# Altium project MCU_PCB.PrjPcb
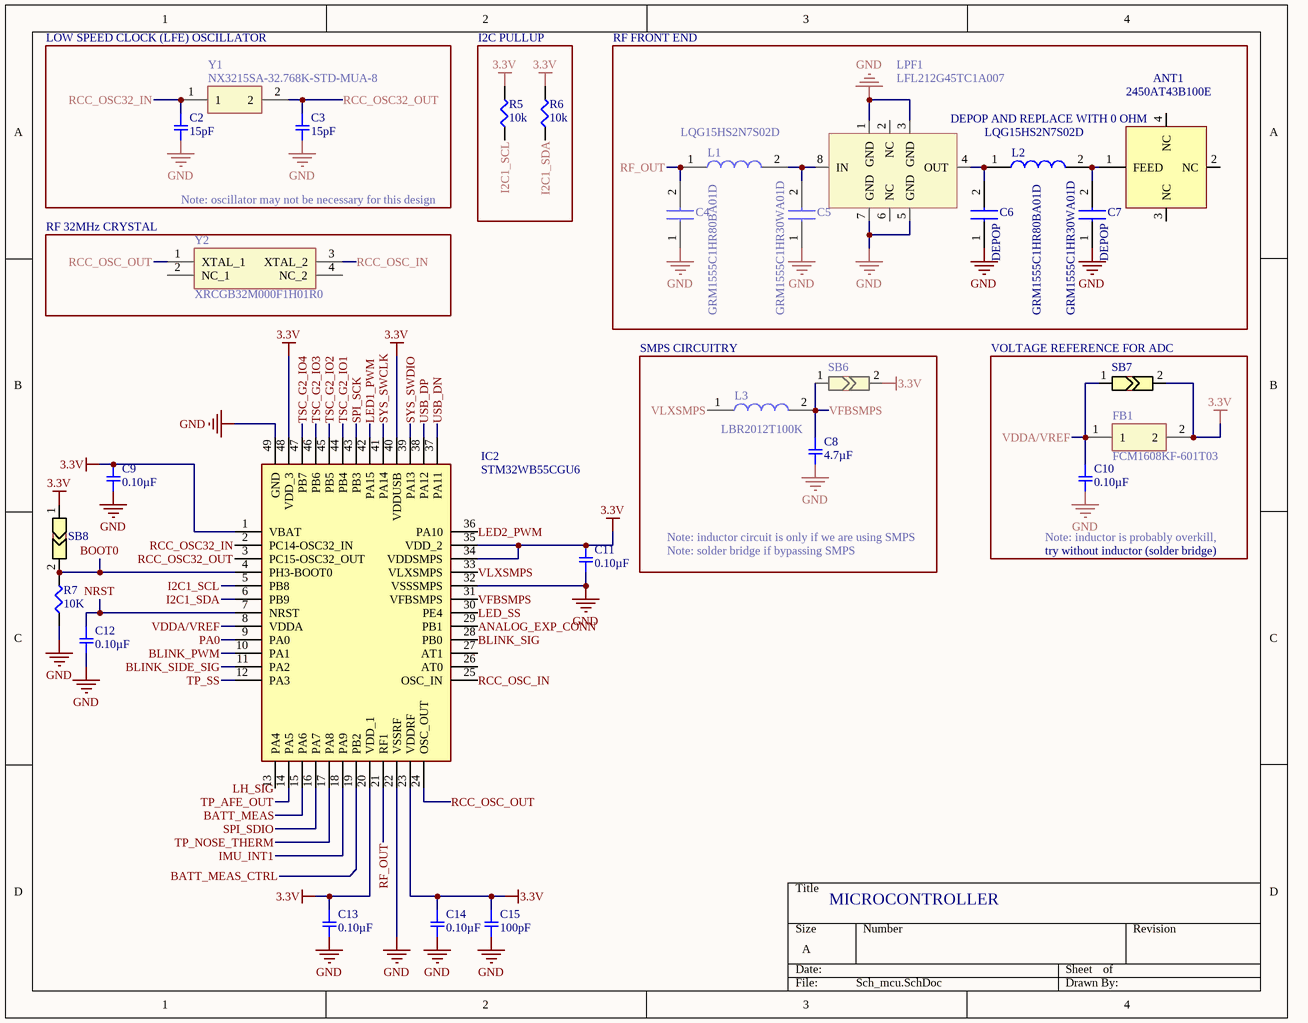
[diagram p0: Sch_mcu.SchDoc]
5 sheets, 94 parts. Net scope: global (net labels, ports and power ports of the same name join across sheets).
Board file: MCU_PCB_v2.PcbDoc
Sheets:
  Sch_mcu.SchDoc
  Sch_sensors.SchDoc
  Sch_external_connectors.SchDoc
  Sch_pwr.SchDoc
  Sch_stackup_mcu_pcb.SchDoc

## Sheet Sch_mcu.SchDoc
size A

### Parts
ANT1  2450AT43B100E  [2450AT43B100E]
C2  15pF  [SMD-0402C]
C3  15pF  [SMD-0402C]
C4  GRM1555C1HR80BA01D  [CAPC1005X55N]
C5  GRM1555C1HR30WA01D  [CAPC1005X55N]
C6  GRM1555C1HR80BA01D  [CAPC1005X55N]
C7  GRM1555C1HR30WA01D  [CAPC1005X55N]
C8  4.7µF  [SMD-0402C]
C9  0.10µF  [SMD-0402C]
C10  0.10µF  [SMD-0402C]
C11  0.10µF  [SMD-0402C]
C12  0.10µF  [SMD-0402C]
C13  0.10µF  [SMD-0402C]
C14  0.10µF  [SMD-0402C]
C15  100pF  [SMD-0402C]
FB1  FCM1608KF-601T03  [BEADC1608X95N]
IC2  STM32WB55CGU6  [QFN50P700X700X65-49N-D]
L1  LQG15HS2N7S02D  [INDC1005X55N]
L2  LQG15HS2N7S02D  [INDC1005X55N]
L3  LBR2012T100K  [INDC2012X145N]
LPF1  LFL212G45TC1A007  [LFL212G45TC1A007]
R5  10k  [SMD-0402-RES]
R6  10k  [SMD-0402-RES]
R7  10K  [SMD-0402-RES]
SB6  SOLDER_JUMPER  [JUMPER_SMD]  (value not drawn)
SB7  SOLDER_JUMPER  [JUMPER_SMD]  (value not drawn)
SB8  SOLDER_JUMPER  [JUMPER_SMD]  (value not drawn)
Y1  NX3215SA-32.768K-STD-MUA-8  [NX3215SA]
Y2  XRCGB32M000F1H01R0  [XRCGB32M000F1H01R0]

### Blocks framed on the sheet
I2C PULLUP: R5 R6
RF 32MHz CRYSTAL: Y2

### Nets
3.3V: C9.1 C11.1 C13.1 C14.1 C15.1 FB1.2 IC2.1(VBAT) IC2.20(VDD_1) IC2.23(VDDRF) IC2.34(VDDSMPS) IC2.35(VDD_2) IC2.40(VDDUSB) IC2.48(VDD_3) R5.2 R6.2 SB6.2 SB7.2 SB8.1
GND: C2.2 C3.2 C4.1 C5.1 C6.1 C7.1 C8.2 C9.2 C10.2 C11.2 C12.2 C13.2 C14.2 C15.2 IC2.22(VSSRF) IC2.32(VSSSMPS) IC2.49(GND) LPF1.1(GND) LPF1.3(GND) LPF1.5(GND) LPF1.7(GND) R7.1
ANALOG_EXP_CONN: IC2.29(PB1)
BATT_MEAS: IC2.15(PA6)
BATT_MEAS_CTRL: IC2.19(PB2)
BLINK_PWM: IC2.10(PA1)
BLINK_SIDE_SIG: IC2.11(PA2)
BLINK_SIG: IC2.28(PB0)
BOOT0: IC2.4(PH3-BOOT0) R7.2 SB8.2
I2C1_SCL: IC2.5(PB8) R5.1
I2C1_SDA: IC2.6(PB9) R6.1
IMU_INT1: IC2.18(PA9)
LED1_PWM: IC2.42(PA15)
LED2_PWM: IC2.36(PA10)
LED_SS: IC2.30(PE4)
LH_SIG: IC2.13(PA4)
NRST: C12.1 IC2.7(NRST)
PA0: IC2.9(PA0)
RCC_OSC32_IN: C2.1 IC2.2(PC14-OSC32_IN) Y1.1
RCC_OSC32_OUT: C3.1 IC2.3(PC15-OSC32_OUT) Y1.2
RCC_OSC_IN: IC2.25(OSC_IN) Y2.3(XTAL_2)
RCC_OSC_OUT: IC2.24(OSC_OUT) Y2.1(XTAL_1)
RF_OUT: C4.2 IC2.21(RF1) L1.1
SPI_SCK: IC2.43(PB3)
SPI_SDIO: IC2.16(PA7)
SYS_SWCLK: IC2.41(PA14)
SYS_SWDIO: IC2.39(PA13)
TP_AFE_OUT: IC2.14(PA5)
TP_NOSE_THERM: IC2.17(PA8)
TP_SS: IC2.12(PA3)
TSC_G2_IO1: IC2.44(PB4)
TSC_G2_IO2: IC2.45(PB5)
TSC_G2_IO3: IC2.46(PB6)
TSC_G2_IO4: IC2.47(PB7)
USB_DN: IC2.37(PA11)
USB_DP: IC2.38(PA12)
VDDA/VREF: C10.1 FB1.1 IC2.8(VDDA) SB7.1
VFBSMPS: C8.1 IC2.31(VFBSMPS) L3.2 SB6.1
VLXSMPS: IC2.33(VLXSMPS) L3.1
NetANT1_1: ANT1.1(FEED) C7.2 L2.2
NetC5_2: C5.2 L1.2 LPF1.8(IN)
NetC6_2: C6.2 L2.1 LPF1.4(OUT)

Not connected (* = marked no-connect by the designer): ANT1 2(NC) 3(NC) 4(NC); IC2 26(AT0) 27(AT1); LPF1 2(NC) 6(NC); Y2 2(NC_1) 4(NC_2)

### Notes on the sheet
- LOW SPEED CLOCK (LFE) OSCILLATOR
- RF FRONT END
- DEPOP AND REPLACE WITH 0 OHM
- Note: oscillator may not be necessary for this design
- (near C6) DEPOP
- (near C7) DEPOP
- SMPS CIRCUITRY
- (near SB7) VOLTAGE REFERENCE FOR ADC
- Note: inductor circuit is only if we are using SMPS
- Note: solder bridge if bypassing SMPS
- (near C10) Note: inductor is probably overkill,
- try without inductor (solder bridge)
- MICROCONTROLLER

### Library data of the parts
C2 C3 = GCM1555C1H150JA16D: CAP CER 15PF 50V NP0 0402; Manufacturer: Murata Electronics North America; Factory Stock: 0; Unit Price (USD): 0.1; Minimum Quantity: 1; Tolerance: ±5%; Temperature Coefficient: C0G, NP0; Datasheets: http://www.murata.com/~/media/webrenewal/support/library/catalog/products/capacitor/mlcc/c03e.ashx; Image: //media.digikey.com/Renders/Murata%20Renders/ZRB-SERIES-0402.jpg; Digi-Key Part Number: 490-11147-1-ND; Part Number: GCM1555C1H150JA16D; Quantity Available: 6185; @ qty: 0; Packaging: Cut Tape (CT); Series: GCM; Part Status: Active; Value: 15pF; Voltage: 50V; Operating Temperature: -55°C ~ 125°C; Features: -; Ratings: AEC-Q200; Applications: Automotive; Mounting Type: Surface Mount, MLCC; Package / Case: 0402 (1005 Metric); Size / Dimension: 0.039" L x 0.020" W (1.00mm x 0.50mm); Height - Seated (Max): -; Thickness (Max): 0.022" (0.55mm); Lead Spacing: -; Lead Style: -
C4 C6 = GRM1555C1HR80BA01D: Capacitor; Manufacturer_Name: Murata Electronics; Datasheet Link: http://www.murata.com/~/media/webrenewal/support/library/catalog/products/capacitor/mlcc/c02e.pdf; Height: 0.55mm; Manufacturer_Part_Number: GRM1555C1HR80BA01D; Mouser Part Number: 81-GRM1555C1HR80BA1D; Mouser Price/Stock: https://www.mouser.com/Search/Refine.aspx?Keyword=81-GRM1555C1HR80BA1D; RS Part Number: 8145426P; RS Price/Stock: http://uk.rs-online.com/web/p/products/8145426P
C5 C7 = GRM1555C1HR30WA01D: Capacitor; Manufacturer_Name: Murata Electronics; Datasheet Link: http://www.murata.com/~/media/webrenewal/support/library/catalog/products/capacitor/mlcc/c02e.pdf; Height: 0.55mm; Manufacturer_Part_Number: GRM1555C1HR30WA01D; Mouser Part Number: 81-GRM1555C1HR30WA1D; Mouser Price/Stock: https://www.mouser.com/Search/Refine.aspx?Keyword=81-GRM1555C1HR30WA1D; RS Part Number: 8145394P; RS Price/Stock: http://uk.rs-online.com/web/p/products/8145394P
C8 = GRM153R60G475ME15D: CAP CER 4.7UF 4V X5R 0402; Manufacturer: Murata Electronics North America; Factory Stock: 0; Unit Price (USD): 0.27; Minimum Quantity: 1; Tolerance: ±20%; Datasheets: http://psearch.en.murata.com/capacitor/product/GRM153R60G475ME15%23.pdf; Image: //media.digikey.com/Renders/Murata%20Renders/ZRB-SERIES-0402.jpg; Digi-Key Part Number: 490-13231-1-ND; Part Number: GRM153R60G475ME15D; Quantity Available: 9100; @ qty: 0; Packaging: Cut Tape (CT); Series: GRM; Part Status: Active; Value: 4.7µF; Voltage: 4V; Temperature Coefficient: X5R; Operating Temperature: -55°C ~ 85°C; Features: -; Ratings: -; Applications: General Purpose; Mounting Type: Surface Mount, MLCC; Package / Case: 0402 (1005 Metric); Size / Dimension: 0.039" L x 0.020" W (1.00mm x 0.50mm); Height - Seated (Max): -; Thickness (Max): 0.013" (0.33mm); Lead Spacing: -; Lead Style: -
C9-C14 = GCM155R71C104KA55D: CAP CER 0.1UF 16V X7R 0402; Manufacturer: Murata Electronics North America; Factory Stock: 0; Unit Price (USD): 0.1; Minimum Quantity: 1; Tolerance: ±10%; Datasheets: http://www.murata.com/~/media/webrenewal/support/library/catalog/products/capacitor/mlcc/c03e.ashx; Image: //media.digikey.com/Renders/Murata%20Renders/ZRB-SERIES-0402.jpg; Digi-Key Part Number: 490-4759-1-ND; Part Number: GCM155R71C104KA55D; Quantity Available: 734194; @ qty: 0; Packaging: Cut Tape (CT); Series: GCM; Part Status: Active; Value: 0.10µF; Voltage: 16V; Temperature Coefficient: X7R; Operating Temperature: -55°C ~ 125°C; Features: -; Ratings: AEC-Q200; Applications: Automotive; Mounting Type: Surface Mount, MLCC; Package / Case: 0402 (1005 Metric); Size / Dimension: 0.039" L x 0.020" W (1.00mm x 0.50mm); Height - Seated (Max): -; Thickness (Max): 0.022" (0.55mm); Lead Spacing: -; Lead Style: -
C15 = GCM1555C1H101JA16D: CAP CER 100PF 50V NP0 0402; Manufacturer: Murata Electronics North America; Factory Stock: 0; Unit Price (USD): 0.1; Minimum Quantity: 1; Tolerance: ±5%; Temperature Coefficient: C0G, NP0; Datasheets: http://www.murata.com/~/media/webrenewal/support/library/catalog/products/capacitor/mlcc/c03e.ashx; Image: //media.digikey.com/Renders/Murata%20Renders/ZRB-SERIES-0402.jpg; Digi-Key Part Number: 490-10669-1-ND; Part Number: GCM1555C1H101JA16D; Quantity Available: 61397; @ qty: 0; Packaging: Cut Tape (CT); Series: GCM; Part Status: Active; Value: 100pF; Voltage: 50V; Operating Temperature: -55°C ~ 125°C; Features: -; Ratings: AEC-Q200; Applications: Automotive; Mounting Type: Surface Mount, MLCC; Package / Case: 0402 (1005 Metric); Size / Dimension: 0.039" L x 0.020" W (1.00mm x 0.50mm); Height - Seated (Max): -; Thickness (Max): 0.022" (0.55mm); Lead Spacing: -; Lead Style: -
FB1 = FCM1608KF-601T03: Ferrite Bead; Manufacturer_Name: TAI-TECH; Datasheet Link: https://www.tai-tech.com.tw/_upload/files/FCM1608-Series.pdf; Height: 0.95mm; Manufacturer_Part_Number: FCM1608KF-601T03
IC2 = STM32WB55CGU6: Integrated Circuit; Manufacturer_Name: STMicroelectronics; Datasheet Link: https://www.st.com/en/microcontrollers/stm32wb55cg.html; Height: 0.65mm; Manufacturer_Part_Number: STM32WB55CGU6; Mouser Part Number: 511-STM32WB55CGU6; Mouser Price/Stock: https://www.mouser.com/Search/Refine.aspx?Keyword=511-STM32WB55CGU6
L1 L2 = LQG15HS2N7S02D: Inductor; Manufacturer_Name: Murata Electronics; Datasheet Link: https://www.arrow.com/en/products/lqg15hs2n7s02d/murata-manufacturing; Height: 0.55mm; Manufacturer_Part_Number: LQG15HS2N7S02D
L3 = LBR2012T100K: Inductor; Manufacturer_Name: TAIYO YUDEN; Datasheet Link: https://componentsearchengine.com/Datasheets/2/LBR2012T100K.pdf; Height: 1.45mm; Manufacturer_Part_Number: LBR2012T100K; Mouser Part Number: 963-LBR2012T100K; Mouser Price/Stock: https://www.mouser.com/Search/Refine.aspx?Keyword=963-LBR2012T100K
R5 R6 = ERJ-2GEJ103X: RES SMD 10K OHM 5% 1/10W 0402; Manufacturer: Panasonic Electronic Components; Factory Stock: 0; Unit Price (USD): 0.00350; @ qty: 1500; Minimum Quantity: 1; Power (Watts): 0.1W, 1/10W; Temperature Coefficient: ±200ppm/°C; Part Number: ERJ-2GEJ103X; Datasheets: http://industrial.panasonic.com/www-cgi/jvcr13pz.cgi?E+PZ+3+AOA0001+ERJ2GEJ103X+7+WW; Image: //media.digikey.com/Photos/Panasonic%20Photos/ERJ-PA2-Series.jpg; Digi-Key Part Number: P10KJCT-ND; Quantity Available: 2560215; Packaging: Cut Tape (CT); Series: ERJ; Part Status: Active; Value: 10k; Tolerance: ±5%; Composition: Thick Film; Features: Automotive AEC-Q200; Operating Temperature: -55°C ~ 155°C; Package / Case: 0402 (1005 Metric); Supplier Device Package: 0402; Size / Dimension: 0.039" L x 0.020" W (1.00mm x 0.50mm); Height - Seated (Max): 0.016" (0.40mm); Number of Terminations: 2; Failure Rate: -
R7 = ERJ-2RKF1003X: RES SMD 10K OHM 1% 1/10W 0402; Manufacturer: Panasonic Electronic Components; Factory Stock: 0; Unit Price (USD): 0.00496; @ qty: 1500; Minimum Quantity: 1; Power (Watts): 0.1W, 1/10W; Temperature Coefficient: ±100ppm/°C; Part Number: ERJ-2RKF1003X; Datasheets: http://industrial.panasonic.com/www-cgi/jvcr13pz.cgi?E+PZ+3+AOA0002+ERJ2RKF1003X+7+WW; Image: //media.digikey.com/Photos/Panasonic%20Photos/ERJ-PA2-Series.jpg; Digi-Key Part Number: P100KLCT-ND; Quantity Available: 2645965; Packaging: Cut Tape (CT); Series: ERJ; Part Status: Active; Value: 10K; Tolerance: ±1%; Composition: Thick Film; Features: Automotive AEC-Q200; Operating Temperature: -55°C ~ 155°C; Package / Case: 0402 (1005 Metric); Supplier Device Package: 0402; Size / Dimension: 0.039" L x 0.020" W (1.00mm x 0.50mm); Height - Seated (Max): 0.016" (0.40mm); Number of Terminations: 2; Failure Rate: -
Y1 = NX3215SA-32.768K-STD-MUA-8: Crystal or Oscillator; Manufacturer_Name: NDK; Datasheet Link: http://www.ndk.com/images/products/catalog/c_NX3215SA-STD-MUA-14_e.pdf; Manufacturer_Part_Number: NX3215SA-32.768K-STD-MUA-8; Mouser Part Number: 344-NX3215SA32768K8; Mouser Price/Stock: https://www.mouser.com/Search/Refine.aspx?Keyword=344-NX3215SA32768K8
Y2 = XRCGB32M000F1H01R0: Crystal or Oscillator; Manufacturer_Name: Murata Electronics; Datasheet Link: https://www.murata.com/en-eu/products/productdetail?partno=XRCGB32M000F1H01R0; Height: 0.7mm; Manufacturer_Part_Number: XRCGB32M000F1H01R0; Mouser Part Number: 81-XRCGB32M000F1H01R; Mouser Price/Stock: https://www.mouser.com/Search/Refine.aspx?Keyword=81-XRCGB32M000F1H01R

## Sheet Sch_sensors.SchDoc
size A
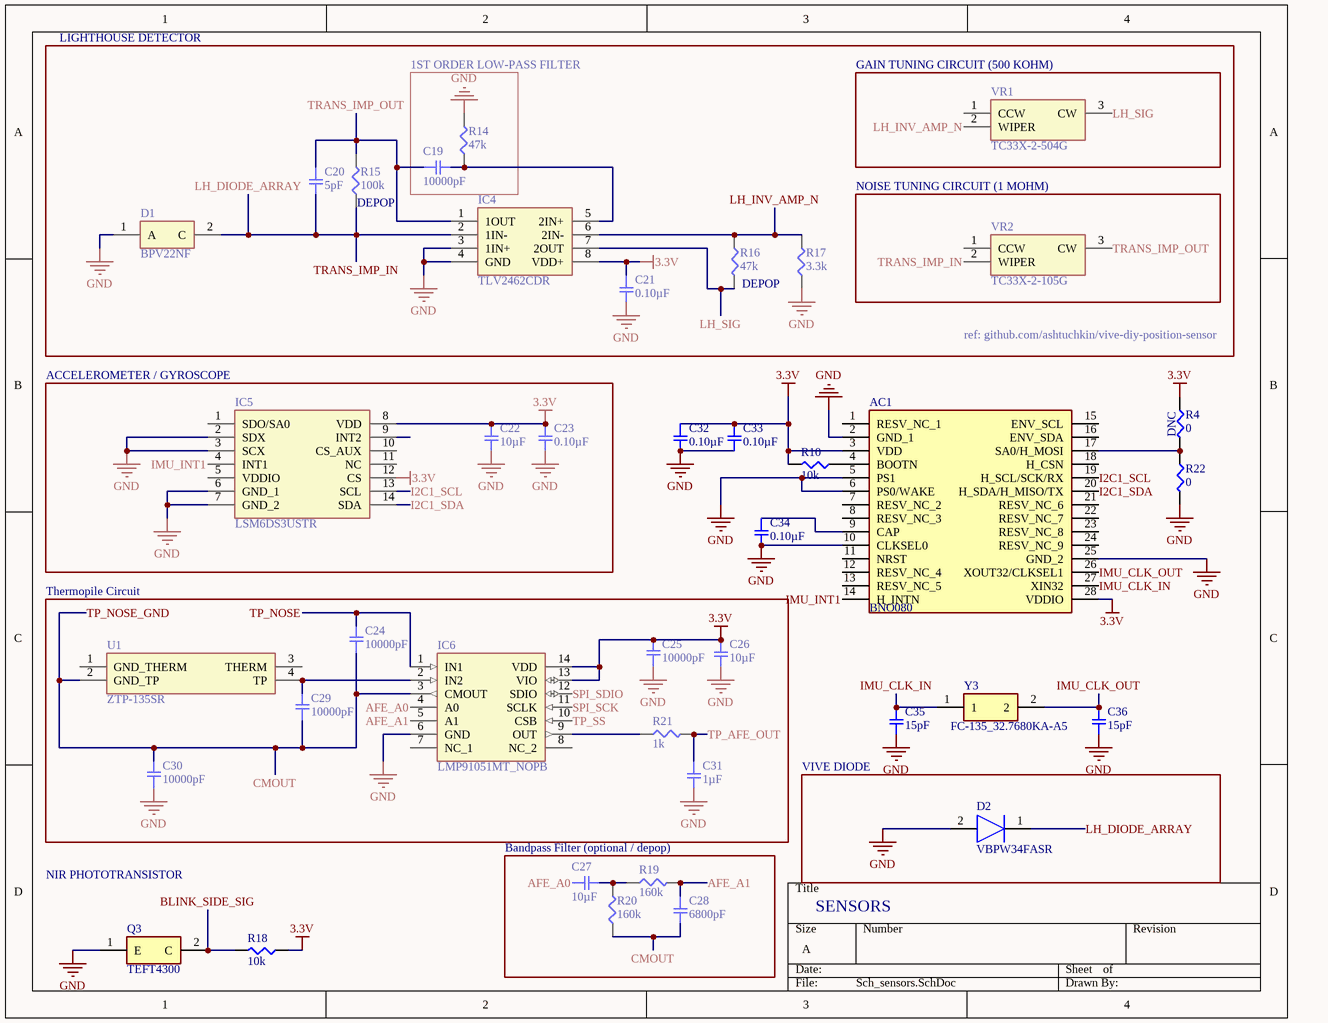
[diagram p1: Sch_sensors.SchDoc]

### Parts
AC1  BNO080  [BNO080]
C19  10000pF  [SMD-0402C]
C20  5pF  [SMD-0402C]
C21  0.10µF  [SMD-0402C]
C22  10µF  [SMD-0402C]
C23  0.10µF  [SMD-0402C]
C24  10000pF  [SMD-0402C]
C25  10000pF  [SMD-0402C]
C26  10µF  [SMD-0402C]
C27  10µF  [SMD-0402C]
C28  6800pF  [SMD-0402C]
C29  10000pF  [SMD-0402C]
C30  10000pF  [SMD-0402C]
C31  1µF  [SMD-0402C]
C32  0.10µF  [CAPC1005X55N]
C33  0.10µF  [CAPC1005X55N]
C34  0.10µF  [CAPC1005X55N]
C35  15pF  [CAPC1005X55N]
C36  15pF  [CAPC1005X55N]
D1  BPV22NF  [TO254P510X450X920-2P]
D2  VBPW34FASR  [VBPW34FASR]
IC4  TLV2462CDR  [SOIC127P600X175-8N]
IC5  LSM6DS3USTR  [LGA-14(2.5X3X0.86)]
IC6  LMP91051MT_NOPB  [SOP65P640X120-14N]
Q3  TEFT4300  [TEFT4300]
R4  0  [SMD-0402-RES]
R10  10k  [SMD-0402-RES]
R14  47k  [SMD-0402-RES]
R15  100k  [SMD-0402-RES]
R16  47k  [SMD-0402-RES]
R17  3.3k  [SMD-0402-RES]
R18  10k  [SMD-0402-RES]
R19  160k  [SMD-0402-RES]
R20  160k  [SMD-0402-RES]
R21  1k  [SMD-0402-RES]
R22  0  [SMD-0402-RES]
U1  ZTP-135SR  [ZTP-135SR]
VR1  TC33X-2-504G  [TC33X-2_1]
VR2  TC33X-2-105G  [TC33X-2_1]
Y3  FC-135_32.7680KA-A5  [FC135327680KAAG0]

### Blocks framed on the sheet
1ST ORDER LOW-PASS FILTER: C19 R14
GAIN TUNING CIRCUIT (500 KOHM): VR1
NOISE TUNING CIRCUIT (1 MOHM): VR2
ACCELEROMETER / GYROSCOPE: C22 C23 IC5
Thermopile Circuit: C24-C26 C29-C31 IC6 R21 U1
VIVE DIODE: D2
Bandpass Filter (optional / depop): C27 C28 R19 R20

### Nets
3.3V: AC1.3(VDD) AC1.28(VDDIO) C21.1 C22.1 C23.1 C25.2 C26.1 C32.1 C33.1 IC4.8(VDD+) IC5.8(VDD) IC5.12(CS) IC6.13(VIO) IC6.14(VDD) R4.1 R10.2 R18.1
GND: AC1.2(GND_1) AC1.5(PS1) AC1.6(PS0/WAKE) AC1.10(CLKSEL0) AC1.25(GND_2) C21.2 C22.2 C23.2 C25.1 C26.2 C30.1 C31.2 C32.2 C33.2 C34.2 C35.2 C36.2 D1.1(A) D2.2(K) IC4.3(1IN+) IC4.4(GND) IC5.2(SDX) IC5.3(SCX) IC5.6(GND_1) IC5.7(GND_2) IC6.6(GND) Q3.1(E) R14.2 R17.1 R22.2
AFE_A0: C27.1 IC6.4(A0)
AFE_A1: C28.1 IC6.5(A1) R19.2
BLINK_SIDE_SIG: Q3.2(C) R18.2
CMOUT: C24.1 C28.2 C29.1 C30.2 IC6.3(CMOUT) R20.1 U1.2(GND_TP)  [also labelled TP_NOSE_GND]
I2C1_SCL: AC1.19(H_SCL/SCK/RX) IC5.13(SCL)
I2C1_SDA: AC1.20(H_SDA/H_MISO/TX) IC5.14(SDA)
IMU_CLK_IN: AC1.27(XIN32) C35.1 Y3.1
IMU_CLK_OUT: AC1.26(XOUT32/CLKSEL1) C36.1 Y3.2
IMU_INT1: AC1.14(H_INTN) IC5.4(INT1)
LH_DIODE_ARRAY: C20.2 D1.2(C) D2.1(A) IC4.2(1IN-) R15.1 VR2.2(WIPER)  [also labelled TRANS_IMP_IN]
LH_INV_AMP_N: IC4.6(2IN-) R16.1 R17.2 VR1.2(WIPER)
LH_SIG: IC4.7(2OUT) R16.2 VR1.3(CW)
SPI_SCK: IC6.11(SCLK)
SPI_SDIO: IC6.12(SDIO)
TP_AFE_OUT: C31.1 R21.2
TP_NOSE: C24.2 IC6.1(IN1)
TP_SS: IC6.10(CSB)
TRANS_IMP_OUT: C19.1 C20.1 IC4.1(1OUT) R15.2 VR2.3(CW)
NetAC1_4: AC1.4(BOOTN) R10.1
NetAC1_9: AC1.9(CAP) C34.1
NetAC1_17: AC1.17(SA0/H_MOSI) R4.2 R22.1
NetC19_2: C19.2 IC4.5(2IN+) R14.1
NetC27_2: C27.2 R19.1 R20.2
NetC29_2: C29.2 IC6.2(IN2) U1.4(TP)
NetIC6_9: IC6.9(OUT) R21.1

Not connected (* = marked no-connect by the designer): AC1 1(RESV_NC_1) 7(RESV_NC_2) 8(RESV_NC_3) 11(NRST) 12(RESV_NC_4) 13(RESV_NC_5) 15(ENV_SCL) 16(ENV_SDA) 18(H_CSN) 21(RESV_NC_6) 22(RESV_NC_7) 23(RESV_NC_8) 24(RESV_NC_9); IC5 1(SDO/SA0) 5(VDDIO) 9(INT2) 10(CS_AUX) 11(NC); IC6 7(NC_1) 8(NC_2); U1 1(GND_THERM) 3(THERM); VR1 1(CCW); VR2 1(CCW)

### Notes on the sheet
- LIGHTHOUSE DETECTOR
- (near R15) DEPOP
- (near R16) DEPOP
- ref: github.com/ashtuchkin/vive-diy-position-sensor
- (near R4) DNC
- NIR PHOTOTRANSISTOR
- SENSORS

### Library data of the parts
AC1 = BNO080: Accelerometer; Manufacturer_Name: Hillcrest Laboratories; Datasheet Link: http://www.hillcrestlabs.com/download/5a05f340566d07c196001ec1; Height: 1.18mm; Manufacturer_Part_Number: BNO080
C19 C24 C25 C29 C30 = GCM155R71H103KA55D: CAP CER 10000PF 50V X7R 0402; Manufacturer: Murata Electronics North America; Factory Stock: 0; Unit Price (USD): 0.1; Minimum Quantity: 1; Tolerance: ±10%; Datasheets: http://www.murata.com/~/media/webrenewal/support/library/catalog/products/capacitor/mlcc/c03e.ashx; Image: //media.digikey.com/Renders/Murata%20Renders/ZRB-SERIES-0402.jpg; Digi-Key Part Number: 490-4762-1-ND; Part Number: GCM155R71H103KA55D; Quantity Available: 650067; @ qty: 0; Packaging: Cut Tape (CT); Series: GCM; Part Status: Active; Value: 10000pF; Voltage: 50V; Temperature Coefficient: X7R; Operating Temperature: -55°C ~ 125°C; Features: -; Ratings: AEC-Q200; Applications: Automotive; Mounting Type: Surface Mount, MLCC; Package / Case: 0402 (1005 Metric); Size / Dimension: 0.039" L x 0.020" W (1.00mm x 0.50mm); Height - Seated (Max): -; Thickness (Max): 0.022" (0.55mm); Lead Spacing: -; Lead Style: -
C20 = GJM1555C1H5R0BB01D: CAP CER 5PF 50V NP0 0402; Manufacturer: Murata Electronics North America; Factory Stock: 0; Unit Price (USD): 0.2; Minimum Quantity: 1; Tolerance: ±0.1pF; Temperature Coefficient: C0G, NP0; Datasheets: http://www.murata.com/~/media/webrenewal/support/library/catalog/products/capacitor/mlcc/c02e.pdf; Image: //media.digikey.com/Renders/Murata%20Renders/ZRB-SERIES-0402.jpg; Digi-Key Part Number: 490-8103-1-ND; Part Number: GJM1555C1H5R0BB01D; Quantity Available: 17055; @ qty: 0; Packaging: Cut Tape (CT); Series: GJM; Part Status: Active; Value: 5pF; Voltage: 50V; Operating Temperature: -55°C ~ 125°C; Features: High Q, Low Loss; Ratings: -; Applications: RF, Microwave, High Frequency; Mounting Type: Surface Mount, MLCC; Package / Case: 0402 (1005 Metric); Size / Dimension: 0.039" L x 0.020" W (1.00mm x 0.50mm); Height - Seated (Max): -; Thickness (Max): 0.022" (0.55mm); Lead Spacing: -; Lead Style: -
C21 C23 C32-C34 = GCM155R71C104KA55D: as C9 on sheet Sch_mcu; Datasheets: http://www.murata.com/~/media/webrenewal/support/library/catalog/products/capacitor/mlcc/c03e.ashx; Image: //media.digikey.com/Renders/Murata%20Renders/ZRB-SERIES-0402.jpg; Digi-Key Part Number: 490-4759-1-ND; Part Number: GCM155R71C104KA55D; Quantity Available: 734194; @ qty: 0; Packaging: Cut Tape (CT); Series: GCM; Part Status: Active; Value: 0.10µF; Voltage: 16V; Temperature Coefficient: X7R; Operating Temperature: -55°C ~ 125°C; Features: -; Ratings: AEC-Q200; Applications: Automotive; Mounting Type: Surface Mount, MLCC; Package / Case: 0402 (1005 Metric); Size / Dimension: 0.039" L x 0.020" W (1.00mm x 0.50mm); Height - Seated (Max): -; Thickness (Max): 0.022" (0.55mm); Lead Spacing: -; Lead Style: -
C22 C26 C27 = GRJ155R60J106ME11D: CAP CER 10UF 6.3V X5R 0402; Manufacturer: Murata Electronics North America; Factory Stock: 0; Unit Price (USD): 0.23; Minimum Quantity: 1; Tolerance: ±20%; Datasheets: http://psearch.en.murata.com/capacitor/product/GRJ155R60J106ME11%23.pdf; Image: //media.digikey.com/Renders/Murata%20Renders/ZRB-SERIES-0402.jpg; Digi-Key Part Number: 490-13211-1-ND; Part Number: GRJ155R60J106ME11D; Quantity Available: 64064; @ qty: 0; Packaging: Cut Tape (CT); Series: GRJ; Part Status: Active; Value: 10µF; Voltage: 6.3V; Temperature Coefficient: X5R; Operating Temperature: -55°C ~ 85°C; Features: Derating Recommended, Soft Termination; Ratings: -; Applications: Boardflex Sensitive; Mounting Type: Surface Mount, MLCC; Package / Case: 0402 (1005 Metric); Size / Dimension: 0.039" L x 0.020" W (1.00mm x 0.50mm); Height - Seated (Max): -; Thickness (Max): 0.028" (0.70mm); Lead Spacing: -; Lead Style: -
C28 = GRM155R71E682KA01J: CAP CER 6800PF 25V X7R 0402; Manufacturer: Murata Electronics North America; Factory Stock: 0; Unit Price (USD): 0.1; Minimum Quantity: 1; Tolerance: ±10%; Datasheets: http://www.murata.com/~/media/webrenewal/support/library/catalog/products/capacitor/mlcc/c02e.pdf; Image: //media.digikey.com/Renders/Murata%20Renders/ZRB-SERIES-0402.jpg; Digi-Key Part Number: 490-11422-1-ND; Part Number: GRM155R71E682KA01J; Quantity Available: 44380; @ qty: 0; Packaging: Cut Tape (CT); Series: GRM; Part Status: Active; Value: 6800pF; Voltage: 25V; Temperature Coefficient: X7R; Operating Temperature: -55°C ~ 125°C; Features: -; Ratings: -; Applications: General Purpose; Mounting Type: Surface Mount, MLCC; Package / Case: 0402 (1005 Metric); Size / Dimension: 0.039" L x 0.020" W (1.00mm x 0.50mm); Height - Seated (Max): -; Thickness (Max): 0.022" (0.55mm); Lead Spacing: -; Lead Style: -
C31 = GCM155C71A105KE38D: CAP CER 1UF 10V X7S 0402; Manufacturer: Murata Electronics North America; Factory Stock: 0; Unit Price (USD): 0.12; Minimum Quantity: 1; Tolerance: ±10%; Datasheets: http://www.murata.com/~/media/webrenewal/support/library/catalog/products/capacitor/mlcc/c03e.ashx; Image: //media.digikey.com/Renders/Murata%20Renders/ZRB-SERIES-0402.jpg; Digi-Key Part Number: 490-13409-1-ND; Part Number: GCM155C71A105KE38D; Quantity Available: 7240; @ qty: 0; Packaging: Cut Tape (CT); Series: GCM; Part Status: Active; Value: 1µF; Voltage: 10V; Temperature Coefficient: X7S; Operating Temperature: -55°C ~ 125°C; Features: -; Ratings: AEC-Q200; Applications: Automotive; Mounting Type: Surface Mount, MLCC; Package / Case: 0402 (1005 Metric); Size / Dimension: 0.039" L x 0.020" W (1.00mm x 0.50mm); Height - Seated (Max): -; Thickness (Max): 0.022" (0.55mm); Lead Spacing: -; Lead Style: -
C35 C36 = GCM1555C1H150JA16D: as C2 on sheet Sch_mcu; Datasheets: http://www.murata.com/~/media/webrenewal/support/library/catalog/products/capacitor/mlcc/c03e.ashx; Image: //media.digikey.com/Renders/Murata%20Renders/ZRB-SERIES-0402.jpg; Digi-Key Part Number: 490-11147-1-ND; Part Number: GCM1555C1H150JA16D; Quantity Available: 6185; @ qty: 0; Packaging: Cut Tape (CT); Series: GCM; Part Status: Active; Value: 15pF; Voltage: 50V; Operating Temperature: -55°C ~ 125°C; Features: -; Ratings: AEC-Q200; Applications: Automotive; Mounting Type: Surface Mount, MLCC; Package / Case: 0402 (1005 Metric); Size / Dimension: 0.039" L x 0.020" W (1.00mm x 0.50mm); Height - Seated (Max): -; Thickness (Max): 0.022" (0.55mm); Lead Spacing: -; Lead Style: -
D1 = BPV22NF: Diode; Manufacturer_Name: Vishay; Allied_Number: R1086877; Datasheet Link: http://www.vishay.com/docs/81509/bpv22nf.pdf; Height: 5.1mm; Manufacturer_Part_Number: BPV22NF; Mouser Part Number: 782-BPV22NF; Mouser Price/Stock: https://www.mouser.com/Search/Refine.aspx?Keyword=782-BPV22NF; RS Part Number: 6997604P; RS Price/Stock: http://uk.rs-online.com/web/p/products/6997604P; Allied Price/Stock: https://www.alliedelec.com/vishay-dale-bpv22nf/R1086877/
D2 = VBPW34FASR: Diode; Manufacturer_Name: Vishay; Datasheet Link: https://www.vishay.com/docs/81127/vbpw34fa.pdf; Height: 1.3mm; Manufacturer_Part_Number: VBPW34FASR; Mouser Part Number: 782-VBPW34FASR; Mouser Price/Stock: https://www.mouser.com/Search/Refine.aspx?Keyword=782-VBPW34FASR; RS Part Number: 7689401; RS Price/Stock: https://uk.rs-online.com/web/p/products/7689401
IC4 = TLV2462CDR: Integrated Circuit; Manufacturer_Name: Texas Instruments; Datasheet Link: http://www.ti.com/lit/gpn/tlv2462; Manufacturer_Part_Number: TLV2462CDR; Mouser Part Number: 595-TLV2462CDR; Mouser Price/Stock: https://www.mouser.com/Search/Refine.aspx?Keyword=595-TLV2462CDR; RS Part Number: 6610379; RS Price/Stock: https://uk.rs-online.com/web/p/products/6610379
IC5 = LSM6DS3USTR: Integrated Circuit; Manufacturer_Name: STMicroelectronics; Datasheet Link: http://www.st.com/content/ccc/resource/technical/document/datasheet/group0/2e/84/27/34/60/8d/49/f2/DM00237513/files/DM00237513.pdf/jcr:content/translations/en.DM00237513.pdf; Manufacturer_Part_Number: LSM6DS3USTR; Mouser Part Number: 511-LSM6DS3USTR; Mouser Price/Stock: https://www.mouser.com/Search/Refine.aspx?Keyword=511-LSM6DS3USTR
IC6 = LMP91051MT_NOPB: Integrated Circuit; Manufacturer_Name: Texas Instruments; Manufacturer_Part_Number: LMP91051MT/NOPB; Datasheet Link: http://www.ti.com/lit/ds/symlink/lmp91051.pdf; Height: 1.2mm; Mouser Part Number: 595-LMP91051MT/NOPB; Mouser Price/Stock: https://www.mouser.com/Search/Refine.aspx?Keyword=595-LMP91051MT%2FNOPB
Q3 = TEFT4300: Transistor; Manufacturer_Name: Vishay; Datasheet Link: https://componentsearchengine.com/Datasheets/2/TEFT4300.pdf; Manufacturer_Part_Number: TEFT4300; Mouser Part Number: 782-TEFT4300; Mouser Price/Stock: https://www.mouser.com/Search/Refine.aspx?Keyword=782-TEFT4300; RS Part Number: 7082731P; RS Price/Stock: http://uk.rs-online.com/web/p/products/7082731P
R4 R22 = ERJ-2GEJ103X: RES SMD 0K OHM 5% 1/10W 0402; Manufacturer: Panasonic Electronic Components; Unit Price (USD): 0.00350; @ qty: 1500; Minimum Quantity: 1; Power (Watts): 0.1W, 1/10W; Temperature Coefficient: ±200ppm/°C; Part Number: ERJ-2GEJ103X; Datasheets: http://industrial.panasonic.com/www-cgi/jvcr13pz.cgi?E+PZ+3+AOA0001+ERJ2GEJ103X+7+WW; Image: //media.digikey.com/Photos/Panasonic%20Photos/ERJ-PA2-Series.jpg; Digi-Key Part Number: P10KJCT-ND; Quantity Available: 2560215; Factory Stock: 0; Packaging: Cut Tape (CT); Series: ERJ; Part Status: Active; Value: 0; Tolerance: ±5%; Composition: Thick Film; Features: Automotive AEC-Q200; Operating Temperature: -55°C ~ 155°C; Package / Case: 0402 (1005 Metric); Supplier Device Package: 0402; Size / Dimension: 0.039" L x 0.020" W (1.00mm x 0.50mm); Height - Seated (Max): 0.016" (0.40mm); Number of Terminations: 2; Failure Rate: -
R10 R18 = ERJ-2GEJ103X: as R5 on sheet Sch_mcu; Part Number: ERJ-2GEJ103X; Datasheets: http://industrial.panasonic.com/www-cgi/jvcr13pz.cgi?E+PZ+3+AOA0001+ERJ2GEJ103X+7+WW; Image: //media.digikey.com/Photos/Panasonic%20Photos/ERJ-PA2-Series.jpg; Digi-Key Part Number: P10KJCT-ND; Quantity Available: 2560215; Packaging: Cut Tape (CT); Series: ERJ; Part Status: Active; Value: 10k; Tolerance: ±5%; Composition: Thick Film; Features: Automotive AEC-Q200; Operating Temperature: -55°C ~ 155°C; Package / Case: 0402 (1005 Metric); Supplier Device Package: 0402; Size / Dimension: 0.039" L x 0.020" W (1.00mm x 0.50mm); Height - Seated (Max): 0.016" (0.40mm); Number of Terminations: 2; Failure Rate: -
R14 R16 = ERJ-2GEJ473X: RES SMD 47K OHM 5% 1/10W 0402; Manufacturer: Panasonic Electronic Components; Factory Stock: 0; Unit Price (USD): 0.00350; @ qty: 1500; Minimum Quantity: 1; Power (Watts): 0.1W, 1/10W; Temperature Coefficient: ±200ppm/°C; Part Number: ERJ-2GEJ473X; Datasheets: http://industrial.panasonic.com/www-cgi/jvcr13pz.cgi?E+PZ+3+AOA0001+ERJ2GEJ473X+7+WW; Image: //media.digikey.com/Photos/Panasonic%20Photos/ERJ-PA2-Series.jpg; Digi-Key Part Number: P47KJCT-ND; Quantity Available: 5182645; Packaging: Cut Tape (CT); Series: ERJ; Part Status: Active; Value: 47k; Tolerance: ±5%; Composition: Thick Film; Features: Automotive AEC-Q200; Operating Temperature: -55°C ~ 155°C; Package / Case: 0402 (1005 Metric); Supplier Device Package: 0402; Size / Dimension: 0.039" L x 0.020" W (1.00mm x 0.50mm); Height - Seated (Max): 0.016" (0.40mm); Number of Terminations: 2; Failure Rate: -
R15 = ERJ-2GEJ104X: RES SMD 100K OHM 5% 1/10W 0402; Manufacturer: Panasonic Electronic Components; Factory Stock: 0; Unit Price (USD): 0.00350; @ qty: 1500; Minimum Quantity: 1; Power (Watts): 0.1W, 1/10W; Temperature Coefficient: ±200ppm/°C; Part Number: ERJ-2GEJ104X; Datasheets: http://industrial.panasonic.com/www-cgi/jvcr13pz.cgi?E+PZ+3+AOA0001+ERJ2GEJ104X+7+WW; Image: //media.digikey.com/Photos/Panasonic%20Photos/ERJ-PA2-Series.jpg; Digi-Key Part Number: P100KJCT-ND; Quantity Available: 2387986; Packaging: Cut Tape (CT); Series: ERJ; Part Status: Active; Value: 100k; Tolerance: ±5%; Composition: Thick Film; Features: Automotive AEC-Q200; Operating Temperature: -55°C ~ 155°C; Package / Case: 0402 (1005 Metric); Supplier Device Package: 0402; Size / Dimension: 0.039" L x 0.020" W (1.00mm x 0.50mm); Height - Seated (Max): 0.016" (0.40mm); Number of Terminations: 2; Failure Rate: -
R17 = ERJ-2GEJ332X: RES SMD 3.3K OHM 5% 1/10W 0402; Manufacturer: Panasonic Electronic Components; Factory Stock: 0; Unit Price (USD): 0.00350; @ qty: 1500; Minimum Quantity: 1; Power (Watts): 0.1W, 1/10W; Temperature Coefficient: ±200ppm/°C; Part Number: ERJ-2GEJ332X; Datasheets: http://industrial.panasonic.com/www-cgi/jvcr13pz.cgi?E+PZ+3+AOA0001+ERJ2GEJ332X+7+WW; Image: //media.digikey.com/Photos/Panasonic%20Photos/ERJ-PA2-Series.jpg; Digi-Key Part Number: P3.3KJCT-ND; Quantity Available: 514266; Packaging: Cut Tape (CT); Series: ERJ; Part Status: Active; Value: 3.3k; Tolerance: ±5%; Composition: Thick Film; Features: Automotive AEC-Q200; Operating Temperature: -55°C ~ 155°C; Package / Case: 0402 (1005 Metric); Supplier Device Package: 0402; Size / Dimension: 0.039" L x 0.020" W (1.00mm x 0.50mm); Height - Seated (Max): 0.016" (0.40mm); Number of Terminations: 2; Failure Rate: -
R19 R20 = ERJ-2GEJ164X: RES SMD 160K OHM 5% 1/10W 0402; Manufacturer: Panasonic Electronic Components; Factory Stock: 0; Unit Price (USD): 0.00350; @ qty: 1500; Minimum Quantity: 1; Power (Watts): 0.1W, 1/10W; Temperature Coefficient: ±200ppm/°C; Part Number: ERJ-2GEJ164X; Datasheets: http://industrial.panasonic.com/www-cgi/jvcr13pz.cgi?E+PZ+3+AOA0001+ERJ2GEJ164X+7+WW; Image: //media.digikey.com/Photos/Panasonic%20Photos/ERJ-PA2-Series.jpg; Digi-Key Part Number: P160KJCT-ND; Quantity Available: 64191; Packaging: Cut Tape (CT); Series: ERJ; Part Status: Active; Value: 160k; Tolerance: ±5%; Composition: Thick Film; Features: Automotive AEC-Q200; Operating Temperature: -55°C ~ 155°C; Package / Case: 0402 (1005 Metric); Supplier Device Package: 0402; Size / Dimension: 0.039" L x 0.020" W (1.00mm x 0.50mm); Height - Seated (Max): 0.016" (0.40mm); Number of Terminations: 2; Failure Rate: -
R21 = ERJ-2GEJ102X: RES SMD 1K OHM 5% 1/10W 0402; Manufacturer: Panasonic Electronic Components; Factory Stock: 0; Unit Price (USD): 0.00350; @ qty: 1500; Minimum Quantity: 1; Power (Watts): 0.1W, 1/10W; Temperature Coefficient: ±200ppm/°C; Part Number: ERJ-2GEJ102X; Datasheets: http://industrial.panasonic.com/www-cgi/jvcr13pz.cgi?E+PZ+3+AOA0001+ERJ2GEJ102X+7+WW; Image: //media.digikey.com/Photos/Panasonic%20Photos/ERJ-PA2-Series.jpg; Digi-Key Part Number: P1.0KJCT-ND; Quantity Available: 1939857; Packaging: Cut Tape (CT); Series: ERJ; Part Status: Active; Value: 1k; Tolerance: ±5%; Composition: Thick Film; Features: Automotive AEC-Q200; Operating Temperature: -55°C ~ 155°C; Package / Case: 0402 (1005 Metric); Supplier Device Package: 0402; Size / Dimension: 0.039" L x 0.020" W (1.00mm x 0.50mm); Height - Seated (Max): 0.016" (0.40mm); Number of Terminations: 2; Failure Rate: -
U1 = ZTP-135SR: Undefined or Miscellaneous; Manufacturer_Name: Amphenol Advanced Sensors; Allied_Number: 70282698; Datasheet Link: https://www.amphenol-sensors.com/en/component/edocman/370-thermopile-ir-sensor-applications/download?Itemid=7967; Manufacturer_Part_Number: ZTP-135SR; Mouser Part Number: 527-ZTP-135SR; Mouser Price/Stock: https://www.mouser.com/Search/Refine.aspx?Keyword=527-ZTP-135SR; Allied Price/Stock: https://www.alliedelec.com/amphenol-advanced-sensors-ztp-135sr/70282698/
VR1 VR2 = TC33X-2-504G: Variable Resistor; Manufacturer_Name: Bourns; Datasheet Link: https://componentsearchengine.com/Datasheets/1/TC33X-2-504G.pdf
  VR1: Manufacturer_Part_Number: TC33X-2-504G; Mouser Part Number: 652-TC33X-2-504G; Mouser Price/Stock: https://www.mouser.com/Search/Refine.aspx?Keyword=652-TC33X-2-504G
  VR2: Manufacturer_Part_Number: TC33X-2-105G; Mouser Part Number: 652-TC33X-2-105G; Mouser Price/Stock: https://www.mouser.com/ProductDetail/Bourns/TC33X-2-105G?qs=CKM7WkAQrJp66Z0w10bj4w%3D%3D
Y3 = FC-135_32.7680KA-A3: Crystal or Oscillator; Manufacturer_Name: Epson Timing; Manufacturer_Part_Number: FC-135 32.7680KA-A5; Datasheet Link: https://support.epson.biz/td/api/doc_check.php?dl=brief_fc-135r_en.pdf; Height: 0mm; Mouser Part Number: 732-FC135-32.76KAA3; Mouser Price/Stock: https://www.mouser.com/Search/Refine.aspx?Keyword=732-FC135-32.76KAA3

## Sheet Sch_external_connectors.SchDoc
size A
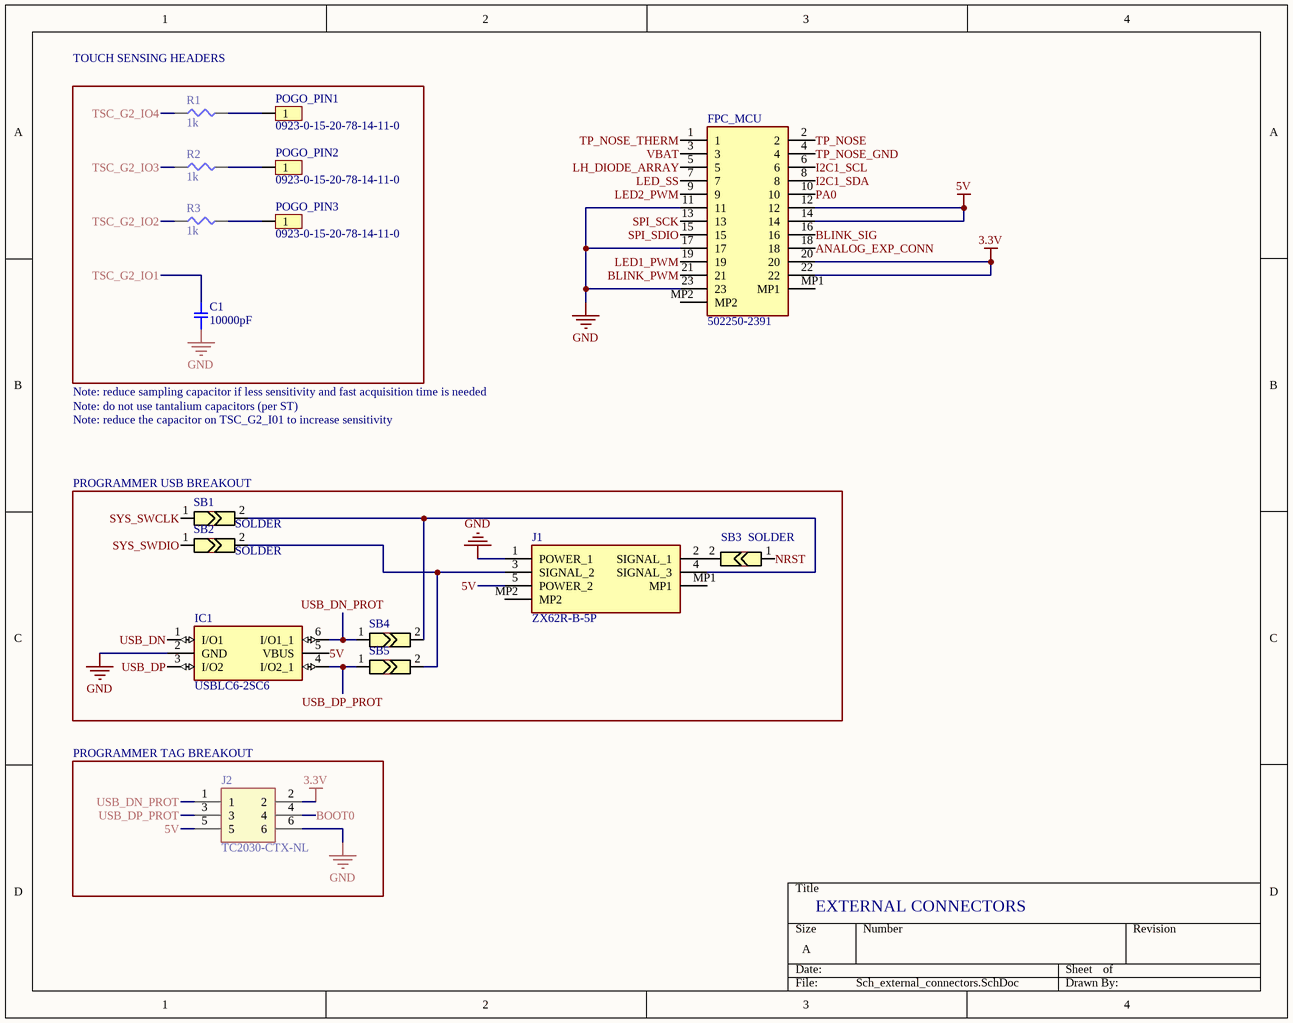
[diagram p2: Sch_external_connectors.SchDoc]

### Parts
C1  10000pF  [SMD-0402C]
FPC_MCU  502250-2391  [5022502391]
IC1  USBLC6-2SC6  [SOT95P280X145-6N]
J1  ZX62R-B-5P  [USB307030A]
J2  TC2030-CTX-NL  [TC2030MCPNL10]
POGO_PIN1  0923-0-15-20-78-14-11-0  [0923-0-15-20-78-14-11-0]
POGO_PIN2  0923-0-15-20-78-14-11-0  [0923-0-15-20-78-14-11-0]
POGO_PIN3  0923-0-15-20-78-14-11-0  [0923-0-15-20-78-14-11-0]
R1  1k  [SMD-0402-RES]
R2  1k  [SMD-0402-RES]
R3  1k  [SMD-0402-RES]
SB1  SOLDER_JUMPER  [JUMPER_SMD]  (value not drawn)
SB2  SOLDER_JUMPER  [JUMPER_SMD]  (value not drawn)
SB3  SOLDER_JUMPER  [JUMPER_SMD]  (value not drawn)
SB4  SOLDER_JUMPER  [JUMPER_SMD]  (value not drawn)
SB5  SOLDER_JUMPER  [JUMPER_SMD]  (value not drawn)

### Blocks framed on the sheet
PROGRAMMER TAG BREAKOUT: J2

### Nets
3.3V: FPC_MCU.20 FPC_MCU.22 J2.2
5V: FPC_MCU.12 FPC_MCU.14 IC1.5(VBUS) J1.5(POWER_2) J2.5
GND: C1.1 FPC_MCU.11 FPC_MCU.17 FPC_MCU.23 IC1.2(GND) J1.1(POWER_1) J2.6
ANALOG_EXP_CONN: FPC_MCU.18
BLINK_PWM: FPC_MCU.21
BLINK_SIG: FPC_MCU.16
BOOT0: J2.4
I2C1_SCL: FPC_MCU.6
I2C1_SDA: FPC_MCU.8
LED1_PWM: FPC_MCU.19
LED2_PWM: FPC_MCU.9
LED_SS: FPC_MCU.7
LH_DIODE_ARRAY: FPC_MCU.5
NRST: SB3.1
PA0: FPC_MCU.10
SPI_SCK: FPC_MCU.13
SPI_SDIO: FPC_MCU.15
SYS_SWCLK: SB1.1
SYS_SWDIO: SB2.1
TP_NOSE: FPC_MCU.2
TP_NOSE_GND: FPC_MCU.4  [project net CMOUT]
TP_NOSE_THERM: FPC_MCU.1
TSC_G2_IO1: C1.2
TSC_G2_IO2: R3.1
TSC_G2_IO3: R2.1
TSC_G2_IO4: R1.1
USB_DN: IC1.1(I/O1)
USB_DN_PROT: IC1.6(I/O1_1) J2.1 SB4.1
USB_DP: IC1.3(I/O2)
USB_DP_PROT: IC1.4(I/O2_1) J2.3 SB5.1
VBAT: FPC_MCU.3
NetJ1_2: J1.2(SIGNAL_1) SB3.2
NetJ1_3: J1.3(SIGNAL_2) SB2.2 SB5.2
NetJ1_4: J1.4(SIGNAL_3) SB1.2 SB4.2
NetPOGO_PIN1_1: POGO_PIN1.1 R1.2
NetPOGO_PIN2_1: POGO_PIN2.1 R2.2
NetPOGO_PIN3_1: POGO_PIN3.1 R3.2

Not connected (* = marked no-connect by the designer): FPC_MCU MP1 MP2; J1 MP1 MP2

### Notes on the sheet
- (near R1) TOUCH SENSING HEADERS
- Note: reduce sampling capacitor if less sensitivity and fast acquisition time is needed
- Note: do not use tantalium capacitors (per ST)
- Note: reduce the capacitor on TSC_G2_I01 to increase sensitivity
- (near SB1) PROGRAMMER USB BREAKOUT
- (near SB1) SOLDER
- (near SB2) SOLDER
- (near SB3) SOLDER
- EXTERNAL CONNECTORS

### Library data of the parts
C1 = GCM155R71H103KA55D: as C19 on sheet Sch_sensors; Datasheets: http://www.murata.com/~/media/webrenewal/support/library/catalog/products/capacitor/mlcc/c03e.ashx; Image: //media.digikey.com/Renders/Murata%20Renders/ZRB-SERIES-0402.jpg; Digi-Key Part Number: 490-4762-1-ND; Part Number: GCM155R71H103KA55D; Quantity Available: 650067; @ qty: 0; Packaging: Cut Tape (CT); Series: GCM; Part Status: Active; Value: 10000pF; Voltage: 50V; Temperature Coefficient: X7R; Operating Temperature: -55°C ~ 125°C; Features: -; Ratings: AEC-Q200; Applications: Automotive; Mounting Type: Surface Mount, MLCC; Package / Case: 0402 (1005 Metric); Size / Dimension: 0.039" L x 0.020" W (1.00mm x 0.50mm); Height - Seated (Max): -; Thickness (Max): 0.022" (0.55mm); Lead Spacing: -; Lead Style: -
FPC_MCU = 502250-2391: Connector; Manufacturer_Name: Molex; Datasheet Link: https://www.molex.com/pdm_docs/sd/5022501791_sd.pdf; Height: 1.85mm; Manufacturer_Part_Number: 502250-2391; Mouser Part Number: 538-502250-2391; Mouser Price/Stock: https://www.mouser.com/Search/Refine.aspx?Keyword=538-502250-2391; System: Connector
IC1 = USBLC6-2SC6: Integrated Circuit; Manufacturer_Name: STMicroelectronics; Allied_Number: 70389689; Datasheet Link: http://www.st.com/st-web-ui/static/active/en/resource/technical/document/datasheet/CD00050750.pdf; Height: 1.45mm; Manufacturer_Part_Number: USBLC6-2SC6; Mouser Part Number: 511-USBLC6-2SC6; Mouser Price/Stock: https://www.mouser.com/Search/Refine.aspx?Keyword=511-USBLC6-2SC6; RS Part Number: 9206266; RS Price/Stock: https://uk.rs-online.com/web/p/products/9206266; Allied Price/Stock: http://www.alliedelec.com/stmicroelectronics-usblc6-2sc6/70389689/
J1 = USB3070-30-A: Connector; Manufacturer_Name: GCT (GLOBAL CONNECTOR TECHNOLOGY); Datasheet Link: https://componentsearchengine.com/Datasheets/2/USB3070-30-A.pdf; Height: 2.8mm; Manufacturer_Part_Number: USB3070-30-A
J2 = TC2030-CTX-NL: Connector; Manufacturer_Name: Tag Connect; Datasheet Link: http://www.tag-connect.com/Materials/TC2030-CTX.pdf; Height: 18mm; Manufacturer_Part_Number: TC2030-CTX-NL
R1-R3 = ERJ-2GEJ102X: as R21 on sheet Sch_sensors; Part Number: ERJ-2GEJ102X; Datasheets: http://industrial.panasonic.com/www-cgi/jvcr13pz.cgi?E+PZ+3+AOA0001+ERJ2GEJ102X+7+WW; Image: //media.digikey.com/Photos/Panasonic%20Photos/ERJ-PA2-Series.jpg; Digi-Key Part Number: P1.0KJCT-ND; Quantity Available: 1939857; Packaging: Cut Tape (CT); Series: ERJ; Part Status: Active; Value: 1k; Tolerance: ±5%; Composition: Thick Film; Features: Automotive AEC-Q200; Operating Temperature: -55°C ~ 155°C; Package / Case: 0402 (1005 Metric); Supplier Device Package: 0402; Size / Dimension: 0.039" L x 0.020" W (1.00mm x 0.50mm); Height - Seated (Max): 0.016" (0.40mm); Number of Terminations: 2; Failure Rate: -

## Sheet Sch_pwr.SchDoc
size A
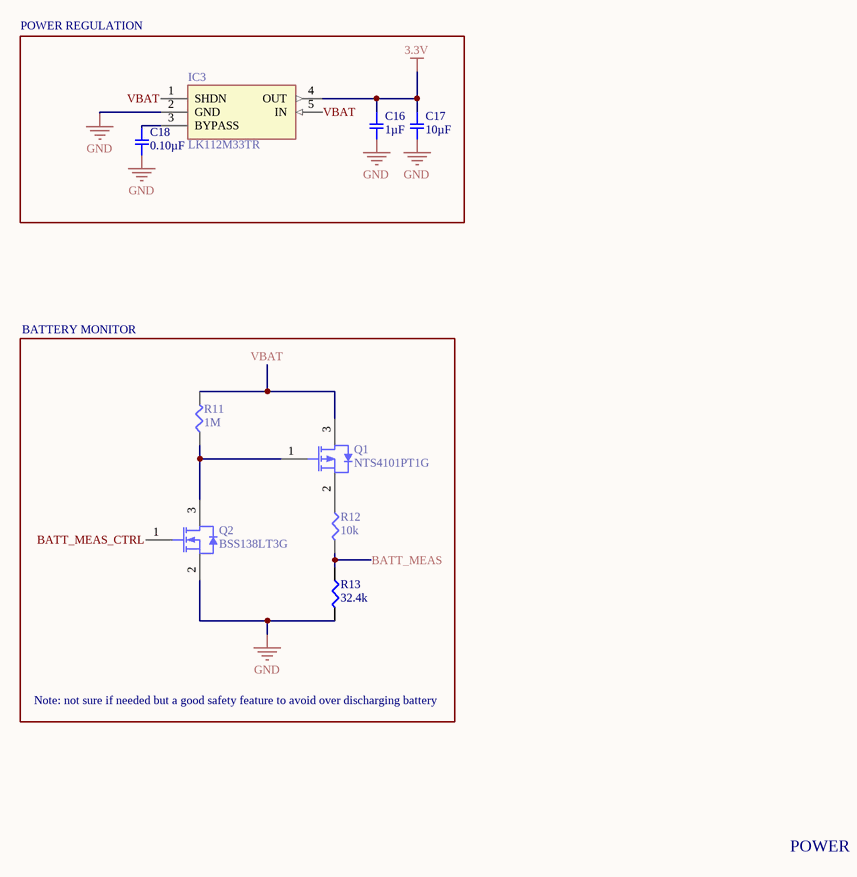
[diagram p3: Sch_pwr.SchDoc]

### Parts
C16  1µF  [SMD-0402C]
C17  10µF  [SMD-0402C]
C18  0.10µF  [SMD-0402C]
IC3  LK112M33TR  [SOT95P280X145-5N]
Q1  NTS4101PT1G  [ONSC-SOT-323-3-419-04_V]
Q2  BSS138LT3G  [ONSC-SOT-23-3-318-08_V]
R11  1M  [SMD-0402-RES]
R12  10k  [SMD-0402-RES]
R13  32.4k  [SMD-0402-RES]

### Blocks framed on the sheet
POWER REGULATION: C16-C18 IC3
BATTERY MONITOR: Q1 Q2 R11-R13

### Nets
3.3V: C16.1 C17.1 IC3.4(OUT)
GND: C16.2 C17.2 C18.2 IC3.2(GND) Q2.2(S) R13.2
BATT_MEAS: R12.2 R13.1
BATT_MEAS_CTRL: Q2.1(G)
VBAT: IC3.1(SHDN) IC3.5(IN) Q1.3(D) R11.2
NetC18_1: C18.1 IC3.3(BYPASS)
NetQ1_1: Q1.1(G) Q2.3(D) R11.1
NetQ1_2: Q1.2(S) R12.1

### Notes on the sheet
- Note: not sure if needed but a good safety feature to avoid over discharging battery
- POWER

### Library data of the parts
C16 = GCM155C71A105KE38D: as C31 on sheet Sch_sensors; Datasheets: http://www.murata.com/~/media/webrenewal/support/library/catalog/products/capacitor/mlcc/c03e.ashx; Image: //media.digikey.com/Renders/Murata%20Renders/ZRB-SERIES-0402.jpg; Digi-Key Part Number: 490-13409-1-ND; Part Number: GCM155C71A105KE38D; Quantity Available: 7240; @ qty: 0; Packaging: Cut Tape (CT); Series: GCM; Part Status: Active; Value: 1µF; Voltage: 10V; Temperature Coefficient: X7S; Operating Temperature: -55°C ~ 125°C; Features: -; Ratings: AEC-Q200; Applications: Automotive; Mounting Type: Surface Mount, MLCC; Package / Case: 0402 (1005 Metric); Size / Dimension: 0.039" L x 0.020" W (1.00mm x 0.50mm); Height - Seated (Max): -; Thickness (Max): 0.022" (0.55mm); Lead Spacing: -; Lead Style: -
C17 = GRJ155R60J106ME11D: as C22 on sheet Sch_sensors; Datasheets: http://psearch.en.murata.com/capacitor/product/GRJ155R60J106ME11%23.pdf; Image: //media.digikey.com/Renders/Murata%20Renders/ZRB-SERIES-0402.jpg; Digi-Key Part Number: 490-13211-1-ND; Part Number: GRJ155R60J106ME11D; Quantity Available: 64064; @ qty: 0; Packaging: Cut Tape (CT); Series: GRJ; Part Status: Active; Value: 10µF; Voltage: 6.3V; Temperature Coefficient: X5R; Operating Temperature: -55°C ~ 85°C; Features: Derating Recommended, Soft Termination; Ratings: -; Applications: Boardflex Sensitive; Mounting Type: Surface Mount, MLCC; Package / Case: 0402 (1005 Metric); Size / Dimension: 0.039" L x 0.020" W (1.00mm x 0.50mm); Height - Seated (Max): -; Thickness (Max): 0.028" (0.70mm); Lead Spacing: -; Lead Style: -
C18 = GCM155R71C104KA55D: as C9 on sheet Sch_mcu; Datasheets: http://www.murata.com/~/media/webrenewal/support/library/catalog/products/capacitor/mlcc/c03e.ashx; Image: //media.digikey.com/Renders/Murata%20Renders/ZRB-SERIES-0402.jpg; Digi-Key Part Number: 490-4759-1-ND; Part Number: GCM155R71C104KA55D; Quantity Available: 734194; @ qty: 0; Packaging: Cut Tape (CT); Series: GCM; Part Status: Active; Value: 0.10µF; Voltage: 16V; Temperature Coefficient: X7R; Operating Temperature: -55°C ~ 125°C; Features: -; Ratings: AEC-Q200; Applications: Automotive; Mounting Type: Surface Mount, MLCC; Package / Case: 0402 (1005 Metric); Size / Dimension: 0.039" L x 0.020" W (1.00mm x 0.50mm); Height - Seated (Max): -; Thickness (Max): 0.022" (0.55mm); Lead Spacing: -; Lead Style: -
IC3 = LK112M33TR: Integrated Circuit; Manufacturer_Name: STMicroelectronics; Allied_Number: 70407288; Datasheet Link: http://www.st.com/st-web-ui/static/active/en/resource/technical/document/datasheet/CD00002190.pdf; Height: 1.45mm; Manufacturer_Part_Number: LK112M33TR; Mouser Part Number: 511-LK112M33; Mouser Price/Stock: https://www.mouser.com/Search/Refine.aspx?Keyword=511-LK112M33; RS Part Number: 6869013P; RS Price/Stock: http://uk.rs-online.com/web/p/products/6869013P; Allied Price/Stock: http://www.alliedelec.com/stmicroelectronics-lk112m33tr/70407288/
Q1 = CMP-1058-00802-1: Power MOSFET, -20 V, -1.37 A, Single P-Channel, 3-Pin SOT-323, Pb-Free, Tape and Reel; Manufacturer: On Semiconductor; VGS Max (V): 8; ID Max (A): 1.37; V(BR)DSS Min (V): 20; Channel Polarity: P Channel; Ciss Typ (pF): 603; Crss Typ (pF): 62; VGS(th) Max (V): 1.5; PD Max (W): 0.329; Coss Typ (pF): 90; Qrr Typ (nC): 4.25; RoHS: Pb-Free; Configuration: Single; PartNumber: NTS4101PT1G; ComponentLink2Description: Datasheet; Mounting Technology: Surface Mount; PackageDescription: 3-Pin Small Outline Transistor, Body 2 x 1.25 mm, Pitch 0.65 mm; Package Type: SC-70-3 / SOT-323-3; ComponentLink2URL: http://www.onsemi.cn/pub_link/Collateral/NTS4101P-D.PDF; PackageReference: SOT-323-3-419-04; PackageVersion: Rev. N, 11/2008; ComponentLink3URL: http://www.onsemi.com/pub_link/Collateral/419-04.PDF; Packing: Tape and Reel; ComponentLink1URL: http://www.onsemi.com/; ComponentLink1Description: Manufacturer URL; ComponentLink3Description: Package Specification; DatasheetVersion: Rev. 3
Q2 = CMP-1058-00765-1: Power MOSFET, 200 mA, 50 V, N-Channel, 3-Pin SOT-23, Pb-Free, Tape and Reel; Manufacturer: On Semiconductor; PD Max (W): 0.225; Channel Polarity: N Channel; Crss Typ (pF): 3.5; Configuration: Single; ID Max (A): 0.2; Ciss Typ (pF): 40; V(BR)DSS Min (V): 50; VGS(th) Max (V): 1.5; Coss Typ (pF): 12; VGS Max (V): 20; ComponentLink2URL: http://www.onsemi.com/pub_link/Collateral/BSS138LT1-D.PDF; PackageDescription: 3-Pin Small Outline Transistor, Body 2.92 x 1.3 mm, Pitch 0.95 mm; Package Type: SOT-23-3; Mounting Technology: Surface Mount; ComponentLink1Description: Manufacturer URL; PackageVersion: Rev. AP, 11/2009; ComponentLink3Description: Package Specification; DatasheetVersion: Rev. 8; RoHS: Pb-Free; Packing: Tape and Reel; PackageReference: SOT-23-3-318-08; PartNumber: BSS138LT3G; ComponentLink3URL: http://www.onsemi.cn/pub_link/Collateral/318-08.PDF; ComponentLink1URL: http://www.onsemi.com/; ComponentLink2Description: Datasheet
R11 = ERJ-2GEJ105X: RES SMD 1M OHM 5% 1/10W 0402; Manufacturer: Panasonic Electronic Components; Factory Stock: 0; Unit Price (USD): 0.00350; @ qty: 1500; Minimum Quantity: 1; Power (Watts): 0.1W, 1/10W; Temperature Coefficient: ±200ppm/°C; Part Number: ERJ-2GEJ105X; Datasheets: http://industrial.panasonic.com/www-cgi/jvcr13pz.cgi?E+PZ+3+AOA0001+ERJ2GEJ105X+7+WW; Image: //media.digikey.com/Photos/Panasonic%20Photos/ERJ-PA2-Series.jpg; Digi-Key Part Number: P1.0MJCT-ND; Quantity Available: 1082572; Packaging: Cut Tape (CT); Series: ERJ; Part Status: Active; Value: 1M; Tolerance: ±5%; Composition: Thick Film; Features: Automotive AEC-Q200; Operating Temperature: -55°C ~ 155°C; Package / Case: 0402 (1005 Metric); Supplier Device Package: 0402; Size / Dimension: 0.039" L x 0.020" W (1.00mm x 0.50mm); Height - Seated (Max): 0.016" (0.40mm); Number of Terminations: 2; Failure Rate: -
R12 = ERJ-2GEJ103X: as R5 on sheet Sch_mcu; Part Number: ERJ-2GEJ103X; Datasheets: http://industrial.panasonic.com/www-cgi/jvcr13pz.cgi?E+PZ+3+AOA0001+ERJ2GEJ103X+7+WW; Image: //media.digikey.com/Photos/Panasonic%20Photos/ERJ-PA2-Series.jpg; Digi-Key Part Number: P10KJCT-ND; Quantity Available: 2560215; Packaging: Cut Tape (CT); Series: ERJ; Part Status: Active; Value: 10k; Tolerance: ±5%; Composition: Thick Film; Features: Automotive AEC-Q200; Operating Temperature: -55°C ~ 155°C; Package / Case: 0402 (1005 Metric); Supplier Device Package: 0402; Size / Dimension: 0.039" L x 0.020" W (1.00mm x 0.50mm); Height - Seated (Max): 0.016" (0.40mm); Number of Terminations: 2; Failure Rate: -
R13 = ERJ-2RKF3242X: RES SMD 32.4K OHM 1% 1/10W 0402; Manufacturer: Panasonic Electronic Components; Factory Stock: 0; Unit Price (USD): 0.00496; @ qty: 1500; Minimum Quantity: 1; Power (Watts): 0.1W, 1/10W; Temperature Coefficient: ±100ppm/°C; Part Number: ERJ-2RKF3242X; Datasheets: http://industrial.panasonic.com/www-cgi/jvcr13pz.cgi?E+PZ+3+AOA0002+ERJ2RKF3242X+7+WW; Image: //media.digikey.com/Photos/Panasonic%20Photos/ERJ-PA2-Series.jpg; Digi-Key Part Number: P32.4KLCT-ND; Quantity Available: 89312; Packaging: Cut Tape (CT); Series: ERJ; Part Status: Active; Value: 32.4k; Tolerance: ±1%; Composition: Thick Film; Features: Automotive AEC-Q200; Operating Temperature: -55°C ~ 155°C; Package / Case: 0402 (1005 Metric); Supplier Device Package: 0402; Size / Dimension: 0.039" L x 0.020" W (1.00mm x 0.50mm); Height - Seated (Max): 0.016" (0.40mm); Number of Terminations: 2; Failure Rate: -

## Sheet Sch_stackup_mcu_pcb.SchDoc
size A

## Nets that join several sheets
3.3V: Sch_mcu (18 pins), Sch_sensors (17 pins), Sch_external_connectors (FPC_MCU.20 FPC_MCU.22 J2.2), Sch_pwr (C16.1 C17.1 IC3.4)
GND: Sch_mcu (22 pins), Sch_sensors (30 pins), Sch_external_connectors (7 pins), Sch_pwr (6 pins)
ANALOG_EXP_CONN: Sch_mcu (IC2.29), Sch_external_connectors (FPC_MCU.18)
BATT_MEAS: Sch_mcu (IC2.15), Sch_pwr (R12.2 R13.1)
BATT_MEAS_CTRL: Sch_mcu (IC2.19), Sch_pwr (Q2.1)
BLINK_PWM: Sch_mcu (IC2.10), Sch_external_connectors (FPC_MCU.21)
BLINK_SIDE_SIG: Sch_mcu (IC2.11), Sch_sensors (Q3.2 R18.2)
BLINK_SIG: Sch_mcu (IC2.28), Sch_external_connectors (FPC_MCU.16)
BOOT0: Sch_mcu (IC2.4 R7.2 SB8.2), Sch_external_connectors (J2.4)
CMOUT: Sch_sensors (7 pins), Sch_external_connectors (FPC_MCU.4)
I2C1_SCL: Sch_mcu (IC2.5 R5.1), Sch_sensors (AC1.19 IC5.13), Sch_external_connectors (FPC_MCU.6)
I2C1_SDA: Sch_mcu (IC2.6 R6.1), Sch_sensors (AC1.20 IC5.14), Sch_external_connectors (FPC_MCU.8)
IMU_INT1: Sch_mcu (IC2.18), Sch_sensors (AC1.14 IC5.4)
LED1_PWM: Sch_mcu (IC2.42), Sch_external_connectors (FPC_MCU.19)
LED2_PWM: Sch_mcu (IC2.36), Sch_external_connectors (FPC_MCU.9)
LED_SS: Sch_mcu (IC2.30), Sch_external_connectors (FPC_MCU.7)
LH_DIODE_ARRAY: Sch_sensors (6 pins), Sch_external_connectors (FPC_MCU.5)
LH_SIG: Sch_mcu (IC2.13), Sch_sensors (IC4.7 R16.2 VR1.3)
NRST: Sch_mcu (C12.1 IC2.7), Sch_external_connectors (SB3.1)
PA0: Sch_mcu (IC2.9), Sch_external_connectors (FPC_MCU.10)
SPI_SCK: Sch_mcu (IC2.43), Sch_sensors (IC6.11), Sch_external_connectors (FPC_MCU.13)
SPI_SDIO: Sch_mcu (IC2.16), Sch_sensors (IC6.12), Sch_external_connectors (FPC_MCU.15)
SYS_SWCLK: Sch_mcu (IC2.41), Sch_external_connectors (SB1.1)
SYS_SWDIO: Sch_mcu (IC2.39), Sch_external_connectors (SB2.1)
TP_AFE_OUT: Sch_mcu (IC2.14), Sch_sensors (C31.1 R21.2)
TP_NOSE: Sch_sensors (C24.2 IC6.1), Sch_external_connectors (FPC_MCU.2)
TP_NOSE_THERM: Sch_mcu (IC2.17), Sch_external_connectors (FPC_MCU.1)
TP_SS: Sch_mcu (IC2.12), Sch_sensors (IC6.10)
TSC_G2_IO1: Sch_mcu (IC2.44), Sch_external_connectors (C1.2)
TSC_G2_IO2: Sch_mcu (IC2.45), Sch_external_connectors (R3.1)
TSC_G2_IO3: Sch_mcu (IC2.46), Sch_external_connectors (R2.1)
TSC_G2_IO4: Sch_mcu (IC2.47), Sch_external_connectors (R1.1)
USB_DN: Sch_mcu (IC2.37), Sch_external_connectors (IC1.1)
USB_DP: Sch_mcu (IC2.38), Sch_external_connectors (IC1.3)
VBAT: Sch_external_connectors (FPC_MCU.3), Sch_pwr (IC3.1 IC3.5 Q1.3 R11.2)